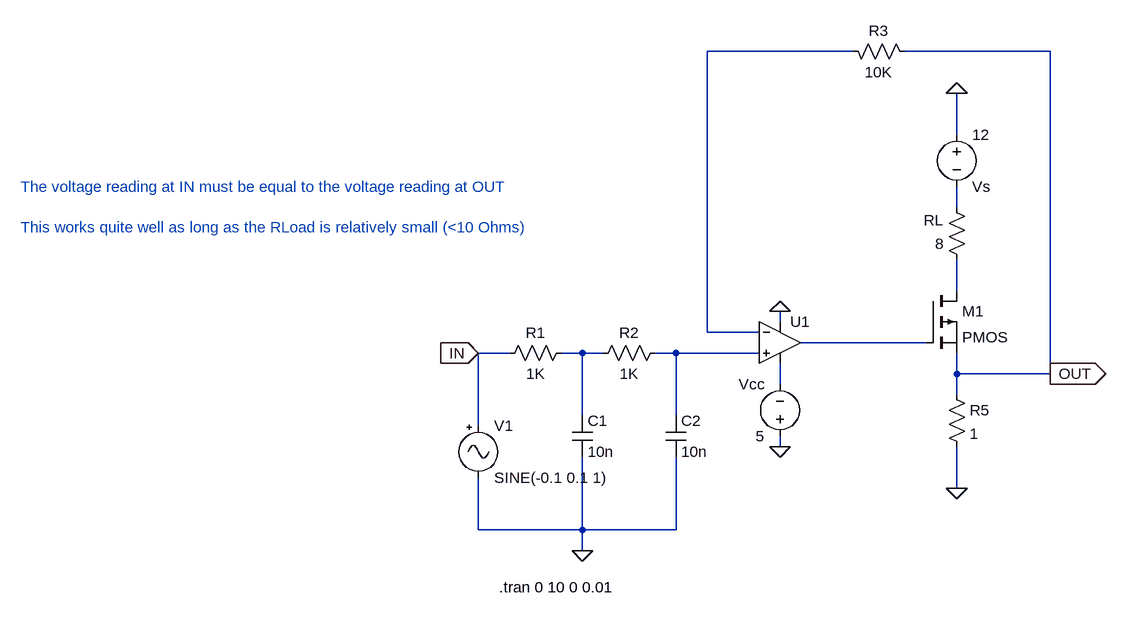
[diagram p0: schematic constant_current_drive_positive.asc]
constant_current_drive_positive.asc, the LTspice schematic file:
Version 4
SHEET 1 880 680
WIRE 240 -304 16 -304
WIRE 544 -304 320 -304
WIRE 400 -176 400 -240
WIRE 400 -64 400 -96
WIRE 400 64 400 16
WIRE 128 112 128 96
WIRE 16 128 16 -304
WIRE 96 128 16 128
WIRE 352 144 160 144
WIRE -288 160 -336 160
WIRE -176 160 -208 160
WIRE -144 160 -176 160
WIRE -32 160 -64 160
WIRE 96 160 -32 160
WIRE 400 192 400 160
WIRE 544 192 544 -304
WIRE 544 192 400 192
WIRE 128 208 128 176
WIRE 400 224 400 192
WIRE -176 256 -176 160
WIRE -32 256 -32 160
WIRE -336 272 -336 160
WIRE 128 304 128 288
WIRE 400 368 400 304
WIRE -336 432 -336 352
WIRE -176 432 -176 320
WIRE -176 432 -336 432
WIRE -32 432 -32 320
WIRE -32 432 -176 432
WIRE -176 464 -176 432
FLAG 400 -240 0
FLAG -176 464 0
FLAG 400 368 0
FLAG 128 96 0
FLAG 128 304 0
FLAG -336 160 IN
IOPIN -336 160 In
FLAG 544 192 OUT
IOPIN 544 192 Out
SYMBOL res 416 32 R180
WINDOW 0 36 76 Left 2
WINDOW 3 36 40 Left 2
SYMATTR InstName RL
SYMATTR Value 8
SYMBOL res 384 208 R0
SYMATTR InstName R5
SYMATTR Value 1
SYMBOL res -192 144 R90
WINDOW 0 0 56 VBottom 2
WINDOW 3 32 56 VTop 2
SYMATTR InstName R1
SYMATTR Value 1K
SYMBOL voltage 400 -192 R0
WINDOW 0 24 96 Left 2
WINDOW 3 24 16 Left 2
WINDOW 123 0 0 Left 0
WINDOW 39 0 0 Left 0
SYMATTR InstName Vs
SYMATTR Value 12
SYMBOL cap -192 256 R0
SYMATTR InstName C1
SYMATTR Value 10n
SYMBOL res -48 144 R90
WINDOW 0 0 56 VBottom 2
WINDOW 3 32 56 VTop 2
SYMATTR InstName R2
SYMATTR Value 1K
SYMBOL cap -48 256 R0
SYMATTR InstName C2
SYMATTR Value 10n
SYMBOL voltage 128 304 R180
WINDOW 0 24 96 Left 2
WINDOW 3 24 16 Left 2
WINDOW 123 0 0 Left 0
WINDOW 39 0 0 Left 0
SYMATTR InstName Vcc
SYMATTR Value 5
SYMBOL OpAmps\\UniversalOpAmp 128 144 R0
SYMATTR InstName U1
SYMBOL pmos 352 64 R0
SYMATTR InstName M1
SYMBOL Misc\\signal -336 256 R0
WINDOW 123 0 0 Left 0
WINDOW 39 0 0 Left 0
SYMATTR InstName V1
SYMATTR Value SINE(-0.1 0.1 1)
SYMBOL res 224 -320 M90
WINDOW 0 0 56 VBottom 2
WINDOW 3 32 56 VTop 2
SYMATTR InstName R3
SYMATTR Value 10K
TEXT -304 520 Left 2 !.tran 0 10 0 0.01
TEXT -1040 -96 Left 2 ;The voltage reading at IN must be equal to the voltage reading at OUT\n \nThis works quite well as long as the RLoad is relatively small (<10 Ohms)

The netlist it stands for:
* constant_current_drive_positive.asc
RL N003 N002 8
R5 OUT 0 1
R1 N005 IN 1K
Vs 0 N002 12
C1 N005 0 10n
R2 N006 N005 1K
C2 N006 0 10n
Vcc 0 N007 5
XU1 N006 N001 0 N007 N004 level1 Avol=1Meg GBW=10Meg Vos=0 En=0 Enk=0 In=0 Ink=0 Rin=500Meg  ; pins In+ In- V+ V- OUT
M1 N003 N004 OUT OUT PMOS
V1 IN 0 SINE(-0.1 0.1 1)
R3 N001 OUT 10K
.model NMOS NMOS
.model PMOS PMOS
.lib standard.mos
.tran 0 10 0 0.01
* The voltage reading at IN must be equal to the voltage reading at OUT
* This works quite well as long as the RLoad is relatively small (<10 Ohms)
.lib UniversalOpAmp1.lib
.backanno
.end